# EasyEDA Pro project stm32f401rct6v1.eprj, board STM32F401RCT6
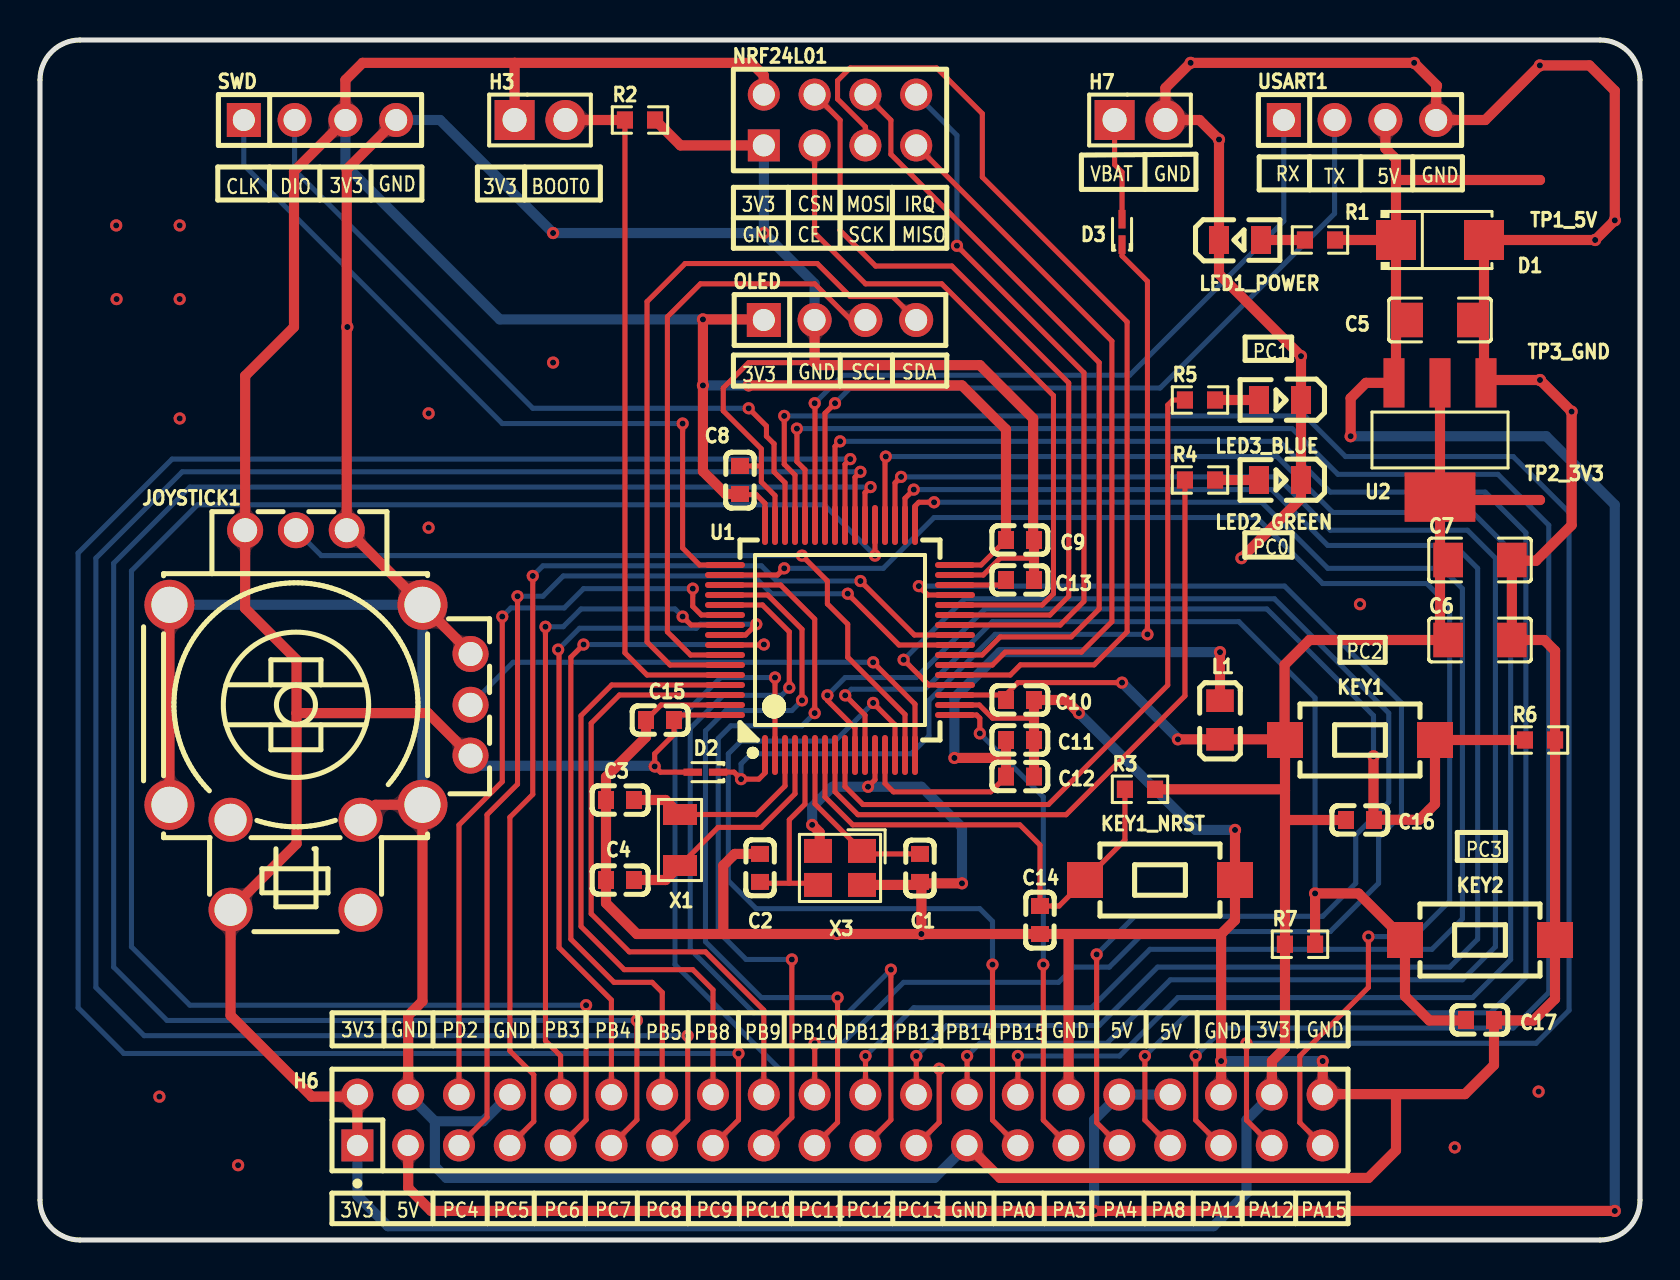
[diagram p3: board, top side]
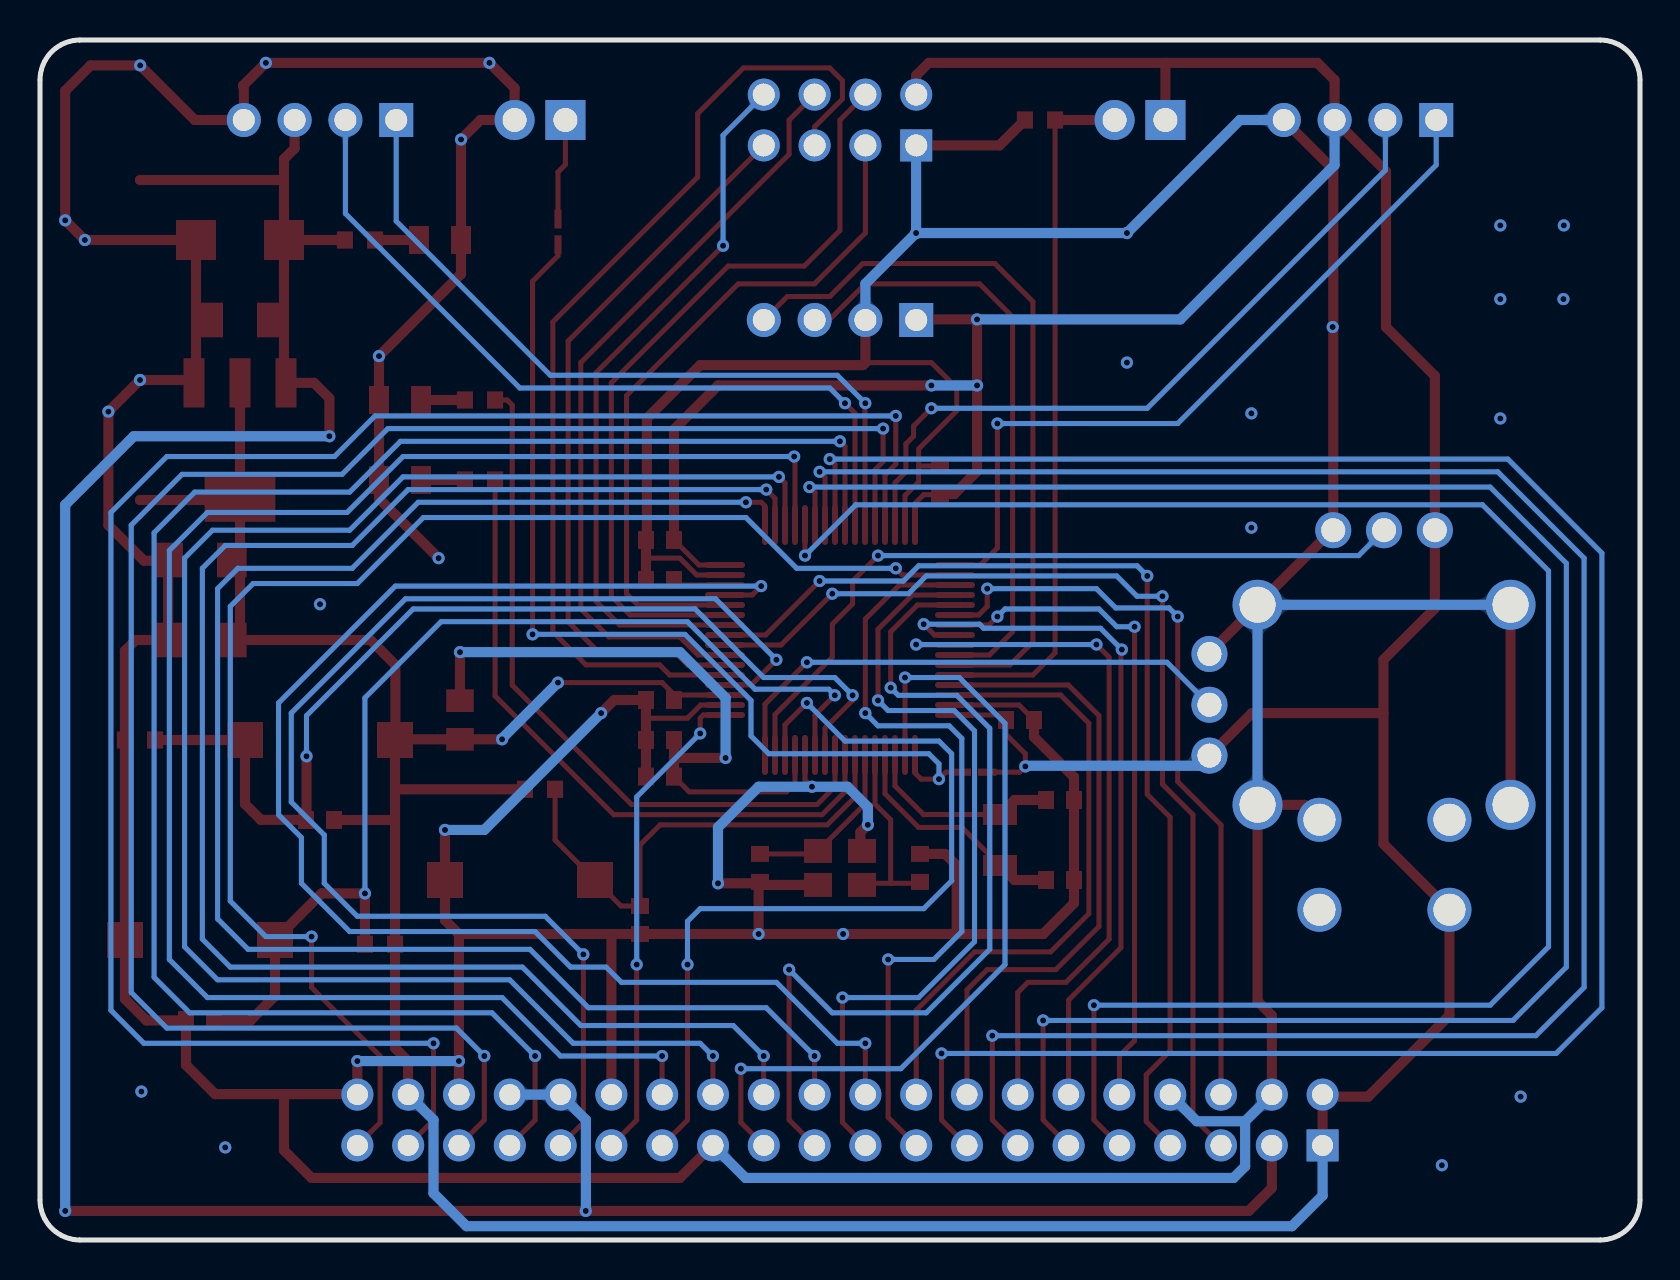
[diagram p4: board, bottom side, seen from below]

Outline 80 x 60 mm; copper layers: Top Layer, Bottom Layer. Coordinates in mm from the lower left corner of the outline.
Outline path: 0,58 0,2 arc(0.59,0.59) 2,0 78,0 arc(79.41,0.59) 80,2 80,58 arc(79.41,59.41) 78,60 2,60 arc(0.59,59.41) 0,58
Stack: Top Layer 0.035mm / Dielectric1 1.51mm FR4 er 4.5 / Bottom Layer 0.035mm

## Design rules (mm)
template: JLCPCB Capability(Two Layers Board)
spacing copperThickness1oz (default): track to track 0.102, other pairs 0.152 to 0.3
spacing copperThickness2oz: track to track 0.203, other pairs 0.152 to 0.3
track width copperThickness1oz (default): min 0.127, default 0.254, max 2.54
track width copperThickness2oz: min 0.203, default 0.254, max 2.54
differential pair differentialPair (default): width min 0.127, default 0.254, max 2.54; gap min 0.152, default 0.152
via viaSize (default): diameter min 0.5, default 0.61, max 10; hole min 0.3, default 0.305, max 6.3

## Placement (name value [footprint] x y rotation side)
C1  22pF  [C0603]  44 18.6 90 top
C2  22pF  [C0603]  36 18.6 270 top
C3  6pF  [C0603]  29 22 180 top
C4  6pF  [C0603]  29 18 180 top
C5  47uF  [C1206]  70 46 0 top
C6  47uF  [C1206]  72 30 0 top
C7  100nF  [C1206]  72 34 0 top
C8  100nF  [C0603]  35 38 90 top
C9  100nF  [C0603]  49 35 0 top
C10  100nF  [C0603]  49 27 0 top
C11  1uF  [C0603]  49 25 0 top
C12  10nF  [C0603]  49 23.17 0 top
C13  4.7uF  [C0603]  49 33 0 top
C14  100nF  [C0603]  50 16 90 top
C15  100nF  [C0603]  31 26 180 top
C16  100nF  [C0603]  66 21 0 top
C17  100nF  [C0603]  72 11 0 top
D1  SMAJ5.0A  [SMA_L4.3-W2.6-LS5.2-RD]  70 50 0 top
D2  1N4148WT  [SOD-523_L1.2-W0.8-LS1.6-RD]  33.27 23.39 180 top
D3  1N4148WT  [SOD-523_L1.2-W0.8-LS1.6-RD]  54.1 50.41 90 top
H3  PZ254V-11-02P  [HDR-TH_2P-P2.54-V-M]  25 56 0 top
H6  X6521WV-2x20H-C60D30  [HDR-TH_40P-2.54-V-M-R2-C20-S2.54]  40 6 0 top
H7  PZ254V-11-02P  [HDR-TH_2P-P2.54-V-M]  55 56 0 top
JOYSTICK1  THB001P  [SW-TH_THB001P]  14 26 0 top
KEY1  TC-3602-4.3-260G  [KEY-SMD_L6.0-W3.6-LS8.3-L]  66 25 0 top
KEY1_NRST  TC-3602-4.3-260G  [KEY-SMD_L6.0-W3.6-LS8.3-L]  56 18 0 top
KEY2  TC-3602-4.3-260G  [KEY-SMD_L6.0-W3.6-LS8.3-L]  72 15 0 top
L1  10uH  [L0805]  59 26 90 top
LED1_POWER  NCD0805R1  [LED0805-R-RD]  60 50 0 top
LED2_GREEN  NCD0805G1  [LED0805-R-RD]  62 38 180 top
LED3_BLUE  NCD0805B2  [LED0805-R-RD]  62 42 180 top
NRF24L01  DS1023-2*4SF11  [HDR-TH_8P-P2.54-V-F-R2-C4-S2.54]  40 56 0 top
OLED  PM254V-11-04-H85  [HDR-TH_4P-P2.54-V-F]  40 46 0 top
R1  1kΩ  [r0603]  64 50 180 top
R2  10kΩ  [R0603]  30 56 0 top
R3  10kΩ  [R0603]  55 22.53 0 top
R4  330Ω  [R0603]  58 38 0 top
R5  330Ω  [R0603]  58 42 0 top
R6  10kΩ  [R0603]  75 25 0 top
R7  10kΩ  [R0603]  63 14.79 0 top
SWD  PZ254V-11-04P  [HDR-TH_4P-P2.54-V-M]  14 56 0 top
TP1_5V  -  [Test-Point-0.5mm]  75 53 0 top
TP2_3V3  -  [Test-Point-0.5mm]  75 37 0 top
TP3_GND  -  [Test-Point-0.5mm]  75 43 0 top
U1  STM32F401RCT6  [LQFP-64_L10.0-W10.0-P0.50-LS12.0-BL]  40 30 0 top
U2  AMS1117-3.3  [SOT-223_L6.5-W3.5-P2.30-LS7.0-BR]  70 40 90 top
USART1  PZ254V-11-04P  [HDR-TH_4P-P2.54-V-M]  66 56 0 top
X1  32.768kHz  [OSC-SMD_L3.2-W1.5]  32 20 270 top
X3  25MHz  [CRYSTAL-SMD_4P-L3.2-W2.5-BL]  40 18.6 180 top

## Footprints (pads in the part's own frame, mm; a bottom-side part is the same pattern mirrored in y, then rotated)
C0603
  rect 0.8x0.9 smd: 1(-0.7,0) 2(0.7,0)
C1206
  rect 1.485x1.728 smd: 1(-1.593,0) 2(1.593,0)
CRYSTAL-SMD_4P-L3.2-W2.5-BL
  rect 1.4x1.2 smd: 1(-1.1,-0.85) 2(1.1,-0.85) 3(1.1,0.85) 4(-1.1,0.85)
HDR-TH_2P-P2.54-V-M
  rect 2x2 hole 1.2: 1(-1.27,0)
  round 2 hole 1.2: 2(1.27,0)
HDR-TH_4P-P2.54-V-F
  rect 1.7x1.7 hole 1.1: 1(-3.81,0)
  round 1.7 hole 1.1: 2(-1.27,0) 3(1.27,0) 4(3.81,0)
HDR-TH_4P-P2.54-V-M
  rect 1.7x1.7 hole 1.1: 1(-3.81,0)
  round 1.7 hole 1.1: 2(-1.27,0) 3(1.27,0) 4(3.81,0)
HDR-TH_8P-P2.54-V-F-R2-C4-S2.54
  rect 1.6x1.6 hole 1.1: 1(-3.81,-1.27)
  round 1.6 hole 1.1: 2(-3.81,1.27) 3(-1.27,-1.27) 4(-1.27,1.27) 5(1.27,-1.27) 6(1.27,1.27) 7(3.81,-1.27) 8(3.81,1.27)
HDR-TH_40P-2.54-V-M-R2-C20-S2.54
  rect 1.6x1.6 hole 1.05: 1(-24.13,-1.27)
  round 1.6 hole 1.05: 2(-24.13,1.27) 3(-21.59,-1.27) 4(-21.59,1.27) 5(-19.05,-1.27) 6(-19.05,1.27) 7(-16.51,-1.27) 8(-16.51,1.27) 9(-13.97,-1.27) 10(-13.97,1.27) 11(-11.43,-1.27) 12(-11.43,1.27) 13(-8.89,-1.27) 14(-8.89,1.27) 15(-6.35,-1.27) 16(-6.35,1.27) 17(-3.81,-1.27) 18(-3.81,1.27) 19(-1.27,-1.27) 20(-1.27,1.27) 21(1.27,-1.27) 22(1.27,1.27) 23(3.81,-1.27) 24(3.81,1.27) 25(6.35,-1.27) 26(6.35,1.27) 27(8.89,-1.27) 28(8.89,1.27) 29(11.43,-1.27) 30(11.43,1.27) 31(13.97,-1.27) 32(13.97,1.27) 33(16.51,-1.27) 34(16.51,1.27) 35(19.05,-1.27) 36(19.05,1.27) 37(21.59,-1.27) 38(21.59,1.27) 39(24.13,-1.27) 40(24.13,1.27)
KEY-SMD_L6.0-W3.6-LS8.3-L
  rect 1.8x1.8 smd: 1(-3.75,0) 2(3.75,0)
L0805
  rect 1.133x1.377 smd: 1(-0.966,0) 2(0.966,0)
LED0805-R-RD
  rect 1x1.399 smd: 1(1.05,0) 2(-1.05,0)
LQFP-64_L10.0-W10.0-P0.50-LS12.0-BL
  oval 0.3x2 smd: 1(-3.75,-5.75) 2(-3.25,-5.75) 3(-2.75,-5.75) 4(-2.25,-5.75) 5(-1.75,-5.75) 6(-1.25,-5.75) 7(-0.75,-5.75) 8(-0.25,-5.75) 9(0.25,-5.75) 10(0.75,-5.75) 11(1.25,-5.75) 12(1.75,-5.75) 13(2.25,-5.75) 14(2.75,-5.75) 15(3.25,-5.75) 16(3.75,-5.75) 33(3.75,5.75) 34(3.25,5.75) 35(2.75,5.75) 36(2.25,5.75) 37(1.75,5.75) 38(1.25,5.75) 39(0.75,5.75) 40(0.25,5.75) 41(-0.25,5.75) 42(-0.75,5.75) 43(-1.25,5.75) 44(-1.75,5.75) 45(-2.25,5.75) 46(-2.75,5.75) 47(-3.25,5.75) 48(-3.75,5.75)
  oval 2x0.3 smd: 17(5.75,-3.75) 18(5.75,-3.25) 19(5.75,-2.75) 20(5.75,-2.25) 21(5.75,-1.75) 22(5.75,-1.25) 23(5.75,-0.75) 24(5.75,-0.25) 25(5.75,0.25) 26(5.75,0.75) 27(5.75,1.25) 28(5.75,1.75) 29(5.75,2.25) 30(5.75,2.75) 31(5.75,3.25) 32(5.75,3.75) 49(-5.75,3.75) 50(-5.75,3.25) 51(-5.75,2.75) 52(-5.75,2.25) 53(-5.75,1.75) 54(-5.75,1.25) 55(-5.75,0.75) 56(-5.75,0.25) 57(-5.75,-0.25) 58(-5.75,-0.75) 59(-5.75,-1.25) 60(-5.75,-1.75) 61(-5.75,-2.25) 62(-5.75,-2.75) 63(-5.75,-3.25) 64(-5.75,-3.75)
OSC-SMD_L3.2-W1.5
  rect 1.05x1.7 smd: 1(-1.275,0) 2(1.275,0)
r0603
  rect 0.807x0.864 smd: 1(-0.753,0)
  rect 0.806x0.864 smd: 2(0.753,0)
R0603
  rect 0.806x0.864 smd: 1(-0.753,0) 2(0.753,0)
SMA_L4.3-W2.6-LS5.2-RD
  rect 2x2 smd: 1(-2.2,0) 2(2.2,0)
SOD-523_L1.2-W0.8-LS1.6-RD
  rect 0.93x0.36 smd: 1(-0.635,0) 2(0.635,0)
SOT-223_L6.5-W3.5-P2.30-LS7.0-BR
  rect 2.465x1.05 smd: 1(2.857,-2.3) 2(2.857,0) 3(2.857,2.3)
  rect 2.465x3.54 smd: 4(-2.857,0)
SW-TH_THB001P
  round 1.8 hole 1.2: 1(7.527,-1.78) 2(7.527,0.76) 3(7.527,3.3) 4(1.337,9.49) 5(-1.202,9.49) 6(-3.743,9.49)
  round 2.5 hole 1.8: 7(-7.527,5.76) 8(-7.527,-4.24) 9(5.122,-4.24) 10(5.122,5.76)
  round 2.2 hole 1.6: a(-4.472,-4.99) b(2.028,-4.99) c(-4.472,-9.49) d(2.028,-9.49)
Test-Point-0.5mm
  round 0.5 smd: 1(0,0)

## Nets
As in the schematic.

Pads without a net: JOYSTICK1 a d

## Via types
v1: diameter 0.61, hole 0.305, Top Layer to Bottom Layer, 111 vias

## Routing (per net, layer and track width the routed paths; a pad name or vN(x,y) marks a point on that pad's centre or on a via; arc(x,y) is an arc through that point)
3V3: length 307.2
  Top Layer w0.254: C8.1 35.03,37.27 35.81,37.27 36.25,36.83 U1.48 ; U1.64 31.95,26.25 C15.1 31.7,25.28 30.73,24.31 v1(30.73,23.68) 31.02,23.39 D2.2 ; 48.3,27.25 U1.19 ; 48.3,27.25 48.3,27.27 48.9,27.87 v1(54.1,27.87) ; 48.3,27.25 C10.1 ; C9.1 47.05,33.75 U1.32
  Top Layer w0.508: 12.83,26.34 19.4,26.34 JOYSTICK1.1 ; 12.83,26.34 12.83,19.81 JOYSTICK1.c 9.53,11.23 13.59,7.17 15.77,7.17 H6.2 H6.1 ; 12.83,26.34 12.83,29.01 10.26,31.58 JOYSTICK1.6 10.26,43.21 12.7,45.65 12.7,53.43 SWD.3 15.27,58 16.13,58.86 23.73,58.86 ; 23.73,58.86 35.56,58.86 36.19,58.23 NRF24L01.2 ; 23.73,58.86 H3.1 ; H6.38 61.59,7.28 61.59,8.95 62.25,9.6 62.25,14.79 ; v1(56.9,25.03) L1.1 62.22,25.03 62.23,25.02 ; 62.25,22.48 62.25,14.79 ; 62.25,22.48 62.19,22.53 R3.2 ; 62.25,22.48 KEY1.1 62.23,25.02 ; 62.25,14.79 R7.1 ; 62.23,25.02 62.23,28.76 63.47,30 C6.1 70,30.41 U2.4 ; OLED.1 36.16,46.03 v1(33.15,46.03) v1(33.15,42.73) 33.15,38.43 34.28,37.3 C8.1 ; U2.4 70.14,37 TP2_3V3.1 ; U2.4 U2.2 ; v1(35.43,42.73) 46.1,42.73 48.3,40.53 C9.1 ; C16.1 62.25,21
  Bottom Layer w0.508: v1(35.43,42.73) v1(33.15,42.73) ; v1(33.15,46.03) 22.99,46.03 15.27,53.75 SWD.3 ; H6.1 15.87,2.22 17.4,0.69 58.67,0.69 60.32,2.34 60.32,6 H6.38 ; v1(56.9,25.03) 56.9,25.08 v1(54.1,27.87) ; JOYSTICK1.1 22.04,23.71 30.7,23.71 v1(30.73,23.68)
+5V: length 149.8
  Top Layer w0.508: v1(65.53,40.19) 65.53,42.09 66.3,42.86 U2.3 67.8,42.96 D1.1 ; v1(78.74,1.45) v1(52.71,1.45) 19.56,1.45 18.41,2.6 H6.3 ; 67.8,53 67.8,54.05 67.27,54.58 USART1.3 ; 67.8,53 D1.1 ; 67.8,53 TP1_5V.1 ; D1.1 R1.1
  Bottom Layer w0.508: v1(78.74,1.45) 78.74,36.76 75.31,40.19 v1(65.53,40.19) ; H6.34 H6.32 52.71,6 52.71,1.46 v1(52.71,1.45)
GND: length 472.4
  Top Layer w0.254: 36.07,38.7 36.07,37.9 36.75,37.22 U1.47 ; 36.07,38.7 36.07,39.55 34.16,41.46 34.16,42.6 35.43,43.87 38.73,43.87 ; 36.07,38.7 C8.2 ; v1(41.4,22.66) 41.75,23.01 U1.12 ; U1.18 46.97,26.75 47.62,26.09 49.7,26.09 ; U1.63 31.05,26.75 C15.2 ; U1.31 47.16,33.25 48.01,34.09 49.66,34.09
  Top Layer w0.508: 59.06,15.3 59.75,15.99 KEY1_NRST.2 v1(59.75,20.5) ; 59.06,15.3 59.06,15.3 v1(59.06,8.95) 59.06,7.28 H6.36 ; 59.06,15.3 C14.1 v1(44.07,15.3) ; 64.13,7.28 64.16,7.29 67.8,7.29 ; 64.13,7.28 H6.40 ; 64.13,7.28 v1(64.13,8.95) ; 34.16,15.3 29.84,15.3 28.3,16.84 C4.2 C3.2 28.3,23.15 30.3,25.15 C15.2 ; 34.16,15.3 v1(39.84,15.3) v1(44.07,15.3) ; 34.16,15.3 34.16,18.72 34.74,19.3 C2.1 ; R2.2 32.02,54.73 NRF24L01.1 ; C12.2 C11.2 C10.2 51.29,27 v1(51.94,26.34) ; JOYSTICK1.7 JOYSTICK1.8 ; X3.2 38.98,19.54 38.98,20.38 v1(38.61,20.76) ; v1(44.07,15.3) 44.07,17.83 ; 44.07,17.83 44,17.9 43.85,17.75 X3.4 ; 44.07,17.83 v1(46.1,17.83) 46.1,17.84 ; OLED.2 38.73,43.87 38.85,43.74 46.99,43.74 49.66,41.08 49.66,35.04 C9.2 C13.2 ; 46.38,4.72 48.01,3.1 66.42,3.1 67.8,4.48 67.8,7.29 ; H6.30 51.43,15.3 ; JOYSTICK1.b 16.78,21.76 JOYSTICK1.9 19.12,11.94 18.41,11.23 H6.4 ; JOYSTICK1.3 21.53,29.36 JOYSTICK1.10 15.39,35.49 JOYSTICK1.4 15.34,53.53 SWD.4 ; 67.8,7.29 71.25,7.29 72.7,8.75 C17.2 72.72,10.98 74.68,10.98 75.75,12.05 KEY2.2 75.75,15 R6.2 75.75,29.46 75.21,30 C6.2 C7.2 73.63,33.97 74.8,33.97 76.58,35.74 v1(76.58,41.42) v1(75,43) 72.44,43 U2.1 72.2,42.96 D1.2 v1(77.76,50) v1(78.74,50.98) 78.74,57.46 77.47,58.73 v1(74.99,58.73) 72.26,56 USART1.4 69.81,57.67 69.85,57.71 v1(68.71,58.86) v1(57.53,58.86) 56.27,57.6 H7.2 57.97,56 v1(58.95,55.03) LED1_POWER.2 58.95,48.29 v1(63.05,44.19) LED3_BLUE.2 LED2_GREEN.2 63.05,37.07 v1(60.07,34.09)
  Bottom Layer w0.508: v1(51.94,26.34) 57.78,20.5 v1(59.75,20.5) ; v1(59.06,8.95) v1(64.13,8.95) ; H6.8 22.16,5.94 19.74,5.94 ; JOYSTICK1.9 JOYSTICK1.10 JOYSTICK1.7 ; SWD.4 20,56 v1(25.65,50.35) v1(36.19,50.35) ; v1(46.1,17.83) 46.1,17.84 46.1,20.63 44.07,22.66 v1(41.4,22.66) 39.62,22.66 38.61,21.65 v1(38.61,20.76) ; NRF24L01.1 36.19,54.72 v1(36.19,50.35) ; H6.25 44.72,3.1 20.32,3.1 19.74,3.68 19.74,5.94 ; v1(36.19,50.35) 38.73,47.81 OLED.2 ; 19.74,5.94 H6.4
  vias: v1(3.81,50.73) v1(3.83,47.05) v1(5.97,7.17) v1(6.98,50.73) v1(6.98,47.05) v1(6.98,41.08) v1(9.91,3.74) v1(15.37,45.65) v1(19.43,41.33) v1(19.43,35.62) v1(25.65,43.87) v1(66,31.79) v1(70.74,4.63) v1(74.93,7.42)
VBAT: length 5.1
  Top Layer w0.254: D3.2 54.1,53.4 53.73,53.77 H7.1
VDDA: length 32
  Top Layer w0.254: U1.13 42.25,22.83 42.67,22.41 47.54,22.41 C12.1
  Top Layer w0.508: 48.3,24.1 C12.1 ; 48.3,24.1 v1(45.72,24.1) ; 48.3,24.1 C11.1 ; L1.2 v1(59,29.39)
  Bottom Layer w0.508: v1(45.72,24.1) 45.72,27.11 48.01,29.39 v1(59,29.39)
ADC1_CHAN1: length 37.9
  Top Layer w0.254: U1.15 43.25,26.28 40.39,29.14 40.39,30.79 39.37,31.81 39.37,32.95 v1(38.1,34.22)
  Bottom Layer w0.254: v1(38.1,34.22) 14.07,34.22 JOYSTICK1.5
ADC1_CHAN2: length 26.5
  Top Layer w0.254: v1(41.66,28.89) 43.75,26.79 U1.16
  Bottom Layer w0.254: JOYSTICK1.2 23.65,28.89 v1(41.66,28.89)
BOOT0: length 35.1
  Top Layer w0.254: U1.60 30.35,28.25 29.25,29.36 R2.1
  Top Layer w0.508: H3.2 R2.1
IIC_SCL: length 30.4
  Top Layer w0.254: U1.58 32.53,29.25 31.37,30.41 31.37,46.16 33.02,47.81 38.74,47.81 40.54,46 OLED.3
IIC_SDA: length 36.8
  Top Layer w0.254: U1.59 31.5,28.75 30.35,29.9 30.35,46.92 32.26,48.82 38.86,48.82 40.51,47.17 42.64,47.17 OLED.4
KEY1_DOWN: length 51.2
  Top Layer w0.254: v1(39.37,27.23) 39.37,26.98 40.75,25.6 U1.10
  Top Layer w0.508: v1(66.68,24.19) 66.68,21.03 C16.2 66.71,21.01 68.96,21.01 69.75,21.8 KEY1.2 R6.1
  Bottom Layer w0.254: v1(66.68,24.19) 66.68,26.22 61.34,31.55 47.24,31.55 43.81,28.12 40.26,28.12 v1(39.37,27.23)
KEY2_UP: length 54.1
  Top Layer w0.254: U1.11 41.25,26.24 v1(40.26,27.23)
  Top Layer w0.508: R7.2 v1(63.75,17.33) 65.92,17.33 KEY2.1 68.25,12.2 69.47,10.98 71.28,10.98 C17.1
  Bottom Layer w0.254: v1(63.75,17.33) 63.75,27.11 59.94,30.92 47.62,30.92 44.25,27.54 40.56,27.54 v1(40.26,27.23)
LED2_G: length 33.1
  Top Layer w0.254: R4.1 57.25,27.2 51.31,21.27 40.89,21.27 39.75,22.41 U1.8
LED3_B: length 35.5
  Top Layer w0.254: R5.1 56.64,42 56.39,41.75 56.39,27.74 50.42,21.77 41.15,21.77 40.25,22.67 U1.9
NRF24L01_CE: length 34.8
  Top Layer w0.254: NRF24L01.3 38.73,50.35 41.28,47.81 45.09,47.81 50.67,42.22 50.67,32.31 50.11,31.75 U1.28
NRF24L01_CSN: length 38.7
  Top Layer w0.254: U1.27 50.5,31.25 51.44,32.19 51.44,42.86 45.59,48.7 41.78,48.7 40,50.47 40,56 NRF24L01.4
NRF24L01_IRQ: length 35.7
  Top Layer w0.254: v1(45.85,49.71) 52.2,43.36 52.2,31.93 51.01,30.75 U1.26
  Bottom Layer w0.254: NRF24L01.8 45.85,55.23 v1(45.85,49.71)
NRST: length 25
  Top Layer w0.254: U1.7 39.25,22.15 40.64,20.76 48.99,20.76 50,19.75 C14.2 50.95,16.7 KEY1_NRST.1 54.25,20 R3.1
OSC32_IN: length 10
  Top Layer w0.254: U1.3 37.25,22.7 35.81,21.27 35.8,21.28 X1.1
  Top Layer w0.508: X1.1 31.28,22 C3.1
OSC32_OUT: length 11.8
  Top Layer w0.254: U1.4 37.75,22.31 36.07,20.63 33.91,20.63 X1.2
  Top Layer w0.508: C4.1 31.28,18 X1.2
OSC_IN: length 9.7
  Top Layer w0.254: 37.47,17.84 38.82,17.84 X3.3 ; 37.47,17.84 37.47,21.01 38.25,21.8 U1.5 ; 37.47,17.84 36.07,17.84 36,17.9
OSC_OUT: length 8.7
  Top Layer w0.254: C1.2 41.25,19.3 X3.1 38.75,21.8 U1.6
PA0: length 43.5
  Top Layer w0.254: U1.14 42.75,25.76 v1(41.66,26.85) ; v1(47.62,13.77) 47.62,6 H6.27
  Bottom Layer w0.254: v1(41.66,26.85) 39.75,24.95 35.05,24.95 34.42,24.31 34.42,17.96 35.81,16.57 46.99,16.57 47.62,15.93 v1(47.62,13.77)
PA3: length 24.5
  Top Layer w0.254: U1.17 46.83,26.25 46.99,26.09 v1(46.99,25.33) ; v1(50.16,13.77) 50.16,6 H6.29
  Bottom Layer w0.254: v1(50.16,13.77) 50.16,22.15 v1(46.99,25.33)
PA4: length 64.6
  Top Layer w0.254: H6.31 52.83,5.87 v1(52.83,14.28) ; v1(43.18,29.01) 44.44,27.75 U1.20
  Bottom Layer w0.254: v1(43.18,29.01) 46.23,32.06 61.72,32.06 67.44,26.34 67.44,21.9 65.79,20.25 65.79,17.84 64.13,16.19 54.74,16.19 v1(52.83,14.28)
PA8: length 88.4
  Top Layer w0.254: U1.41 39.75,39.68 v1(40,39.93) ; H6.33 55.25,6 v1(55.25,9.2)
  Bottom Layer w0.254: v1(40,39.93) 61.98,39.93 64.52,37.39 72.26,37.39 74.29,35.36 74.29,13.14 72.52,11.36 57.4,11.36 v1(55.25,9.2)
PA11: length 91.9
  Top Layer w0.254: U1.44 38.25,38.51 37.85,38.92 v1(37.85,40.57) ; H6.35 57.78,6 v1(57.78,9.2)
  Bottom Layer w0.254: v1(57.78,9.2) 59.18,10.6 73.66,10.6 75.44,12.38 75.44,35.74 72.9,38.28 64.9,38.28 62.61,40.57 v1(37.85,40.57)
PA12: length 94.3
  Top Layer w0.254: v1(60.32,9.84) 60.32,6 H6.37 ; v1(37.21,41.2) 37.21,38.79 37.75,38.25 U1.45
  Bottom Layer w0.254: v1(37.21,41.2) 63.25,41.2 65.28,39.17 73.66,39.17 76.45,36.38 76.45,11.49 74.8,9.84 v1(60.32,9.84)
PA15: length 71.1
  Top Layer w0.254: H6.39 62.99,5.87 62.99,9.2 66.42,12.63 v1(66.42,15.17) ; v1(37.21,33.58) 36.88,33.25 U1.50
  Bottom Layer w0.254: v1(66.42,15.17) 68.71,15.17 70.49,16.95 70.49,31.68 69.34,32.82 64.13,32.82 60.83,36.12 44.7,36.12 42.16,33.58 v1(37.21,33.58)
PB3: length 33.4
  Top Layer w0.254: U1.55 32.55,30.75 v1(32.13,31.17) ; v1(25.27,30.66) 25.27,9.96 26.03,9.21 H6.10
  Bottom Layer w0.254: v1(32.13,31.17) 31.75,31.55 27.05,31.55 26.16,30.66 v1(25.27,30.66)
PB4: length 35.6
  Top Layer w0.254: v1(35.81,30.79) 35.27,30.25 U1.56 ; H6.12 28.57,12 25.95,14.62 25.95,29.47 v1(25.91,29.52)
  Bottom Layer w0.254: v1(25.91,29.52) 26.97,30.59 32.82,30.59 33.02,30.79 v1(35.81,30.79)
PB5: length 36.8
  Top Layer w0.254: U1.57 36.17,29.75 v1(36.19,29.77) ; v1(27.18,29.77) 26.54,29.14 26.54,15.04 28.7,12.88 30.61,12.88 31.12,12.38 31.12,9.84 31.11,9.84 H6.14
  Bottom Layer w0.254: v1(36.19,29.77) v1(27.18,29.77)
PB8: length 31.5
  Top Layer w0.254: H6.16 33.65,12.51 32.64,13.52 29.21,13.52 27.05,15.68 27.05,26.22 28.58,27.75 U1.61
PB9: length 31.7
  Top Layer w0.254: U1.62 28.97,27.25 27.56,25.84 27.56,16.31 29.46,14.41 33.27,14.41 36.19,11.49 H6.18
PB10: length 72.1
  Top Layer w0.254: H6.20 38.74,7.28 v1(38.74,9.84) ; U1.29 44.39,32.25 v1(43.94,32.69)
  Bottom Layer w0.254: v1(38.74,9.84) 40.13,9.84 43.18,12.88 50.93,12.88 51.69,13.64 53.47,13.64 55.25,15.42 64.52,15.42 66.93,17.84 66.93,20.12 68.07,21.27 68.07,26.85 62.23,32.69 v1(43.94,32.69)
PB12: length 81.3
  Top Layer w0.254: U1.33 43.75,36.69 43.94,36.89 v1(44.7,36.89) ; H6.22 41.28,7.28 v1(41.28,9.2)
  Bottom Layer w0.254: v1(44.7,36.89) 61.09,36.89 64.39,33.58 70.1,33.58 71.12,32.57 71.12,16.06 69.6,14.53 55.5,14.53 52.58,11.61 43.69,11.61 v1(41.28,9.2)
PB13: length 82.7
  Top Layer w0.254: U1.34 43.25,37.08 v1(43.69,37.52) ; H6.24 43.81,7.28 v1(43.81,9.2)
  Bottom Layer w0.254: v1(43.69,37.52) 61.59,37.52 64.39,34.73 70.74,34.73 71.88,33.58 71.88,15.04 70.49,13.64 55.88,13.64 52.96,10.72 45.34,10.72 v1(43.81,9.2)
PB14: length 84
  Top Layer w0.254: v1(43.05,38.16) 42.75,37.85 U1.35 ; v1(46.35,9.2) 46.35,7.28 H6.26
  Bottom Layer w0.254: v1(46.35,9.2) 46.99,9.84 53.34,9.84 56.51,13.01 71.12,13.01 72.77,14.66 72.77,34.09 71.37,35.49 64.52,35.49 61.85,38.16 v1(43.05,38.16)
PB15: length 85.6
  Top Layer w0.254: v1(42.29,39.17) 42.25,39.13 U1.36 ; H6.28 48.9,7.28 v1(48.9,9.2)
  Bottom Layer w0.254: v1(42.29,39.17) 61.85,39.17 64.64,36.38 71.63,36.38 73.53,34.47 73.53,14.03 71.63,12.12 56.9,12.12 53.97,9.2 v1(48.9,9.2)
PC4: length 52.4
  Top Layer w0.254: v1(40.39,32.31) 42.95,29.75 U1.24 ; v1(23.88,32.19) 23.88,22.79 22.35,21.27 22.35,6.13 H6.5
  Bottom Layer w0.254: v1(23.88,32.19) 25.15,32.19 26.16,33.2 35.69,33.2 36.58,32.31 v1(40.39,32.31)
PC5: length 52.8
  Top Layer w0.254: H6.7 24.69,5.93 24.69,8.26 23.5,9.45 23.5,21.14 24.64,22.28 v1(24.64,33.2) 24.69,33.15 ; v1(41.02,32.95) 43.72,30.25 U1.25
  Bottom Layer w0.254: v1(24.64,33.2) 25.15,33.71 36.07,33.71 36.83,32.95 v1(41.02,32.95)
PC6: length 91.4
  Top Layer w0.254: v1(27.31,11.74) 27.31,6 H6.9 ; U1.37 v1(41.75,34.22)
  Bottom Layer w0.254: v1(27.31,11.74) 7.49,11.74 4.57,14.66 4.57,33.46 7.87,36.76 39.21,36.76 v1(41.75,34.22)
PC7: length 95.7
  Top Layer w0.254: v1(29.84,10.98) 29.84,6 H6.11 ; U1.38 41.25,37.37 v1(41.53,37.65)
  Bottom Layer w0.254: v1(41.53,37.65) 7.49,37.65 3.68,33.84 3.68,13.64 6.35,10.98 v1(29.84,10.98)
PC8: length 100.9
  Top Layer w0.254: H6.13 32.38,6 v1(32.38,10.22) ; U1.39 40.75,38.14 v1(41.02,38.41)
  Bottom Layer w0.254: v1(41.02,38.41) 7.11,38.41 2.79,34.09 2.79,12.63 5.21,10.22 v1(32.38,10.22)
PC9: length 105.8
  Top Layer w0.254: v1(34.93,9.33) 34.93,6 H6.15 ; U1.40 40.25,38.78 v1(40.51,39.05)
  Bottom Layer w0.254: v1(40.51,39.05) 6.6,39.05 1.91,34.35 1.91,11.61 4.19,9.33 v1(34.93,9.33)
PC10: length 39
  Top Layer w0.254: v1(38.74,26.34) 38.74,31.04 37.03,32.75 U1.51 ; v1(37.59,14.03) 37.59,6.13 H6.17
  Bottom Layer w0.254: v1(37.59,14.03) 35.31,14.03 33.91,15.42 33.91,25.08 34.54,25.71 38.1,25.71 v1(38.74,26.34)
PC11: length 39.7
  Top Layer w0.254: U1.52 36.39,32.25 38.1,30.54 v1(38.1,26.98) ; v1(39.88,12.12) 39.88,5.88 H6.19
  Bottom Layer w0.254: v1(38.1,26.98) 37.59,26.47 34.29,26.47 33.27,25.46 33.27,14.92 36.07,12.12 v1(39.88,12.12)
PC12: length 45
  Top Layer w0.254: v1(37.47,27.61) 37.47,30.41 36.12,31.75 U1.53 ; v1(42.54,13.52) 42.54,6 H6.21
  Bottom Layer w0.254: v1(42.54,13.52) 40.39,11.36 35.69,11.36 32.51,14.53 32.51,25.58 34.16,27.23 37.08,27.23 v1(37.47,27.61)
PC13: length 41.6
  Top Layer w0.254: H6.23 44.96,5.88 v1(44.96,8.56) ; U1.2 v1(36.75,28.12)
  Bottom Layer w0.254: v1(44.96,8.56) 36.96,8.56 31.75,13.77 31.75,25.84 34.04,28.12 v1(36.75,28.12)
PD2: length 37.6
  Top Layer w0.254: U1.54 33.07,31.25 32.64,31.68 v1(32.64,32.57) ; H6.6 20.95,20.75 23.11,22.92 v1(23.11,31.17)
  Bottom Layer w0.254: v1(23.11,31.17) 23.55,31.6 26.21,31.6 27.18,32.57 v1(32.64,32.57)
SPI1_MISO: length 36.6
  Top Layer w0.254: NRF24L01.7 53.59,44.95 53.59,30.92 52.07,29.39 48.26,29.39 47.62,28.75 U1.22
SPI1_MOSI: length 38.7
  Top Layer w0.254: NRF24L01.6 42.54,56 42.54,54.28 52.96,43.87 52.96,31.55 51.56,30.16 48.01,30.16 47.1,29.25 U1.23
SPI1_SCK: length 50.7
  Top Layer w0.254: U1.21 48.51,28.25 49.02,28.76 52.71,28.76 54.36,30.41 54.36,45.9 47.12,53.14 47.12,56.32 44.83,58.6 40.51,58.6 39.88,57.97 39.88,57.05 41.27,55.66 NRF24L01.5
SWCLK: length 38.2
  Top Layer w0.254: v1(32.13,40.82) 32.13,34.6 32.98,33.75 U1.49
  Bottom Layer w0.254: v1(32.13,40.82) 23.11,40.82 10.19,53.75 SWD.1
SWDIO: length 36.7
  Top Layer w0.254: v1(35.43,41.58) 36.32,40.7 36.32,40.19 36.7,39.81 36.7,38.41 37.25,37.86 U1.46
  Bottom Layer w0.254: v1(35.43,41.58) 24.64,41.58 12.73,53.49 SWD.2
USART1_RX: length 38.4
  Top Layer w0.254: v1(38.74,41.84) 38.75,41.82 U1.43
  Bottom Layer w0.254: v1(38.74,41.84) 40.13,43.24 54.48,43.24 62.19,50.94 USART1.1
USART1_TX: length 39.9
  Top Layer w0.254: v1(39.75,41.84) 39.25,41.34 U1.42
  Bottom Layer w0.254: v1(39.75,41.84) 40.51,42.6 56.01,42.6 64.73,51.32 USART1.2
VCAP1: length 2.7
  Top Layer w0.254: C13.1 48.05,32.75 U1.30
$1N3059: length 2.2
  Top Layer w0.508: LED1_POWER.1 R1.2
$1N4213: length 48.3
  Top Layer w0.254: D3.1 54.1,49.2 55.37,47.94 v1(55.37,30.28) ; D2.1 34.7,23.39 v1(35.05,23.04) 35.94,23.04 36.25,23.35 U1.1
  Bottom Layer w0.254: v1(35.05,23.04) 35.05,23.81 35.56,24.31 43.56,24.31 44.45,25.2 44.45,26.98 47.75,30.28 v1(55.37,30.28)
$1N8046: length 2.2
  Top Layer w0.508: R4.2 LED2_GREEN.1
$1N8049: length 2.2
  Top Layer w0.508: R5.2 LED3_BLUE.1

## Copper pours and planes (outline as drawn; the poured copper is in the pictures)
GND on Top Layer: 0,58 0.02,58.28 0.08,58.56 0.18,58.83 0.32,59.08 0.49,59.31 0.69,59.51 0.92,59.68 1.17,59.82 1.44,59.92 1.72,59.98 2,60 78,60 78.28,59.98 78.56,59.92 78.83,59.82 79.08,59.68 79.31,59.51 79.51,59.31 79.68,59.08 79.82,58.83 79.92,58.56 79.98,58.28 80,58 80,2 79.98,1.72 79.92,1.44 79.82,1.17 79.68,0.92 79.51,0.69 79.31,0.49 79.08,0.32 78.83,0.18 78.56,0.08 78.28,0.02 78,0 2,0 1.72,0.02 1.44,0.08 1.17,0.18 0.92,0.32 0.69,0.49 0.49,0.69 0.32,0.92 0.18,1.17 0.08,1.44 0.02,1.72 0,2
GND on Bottom Layer: 0,58 0.02,58.28 0.08,58.56 0.18,58.83 0.32,59.08 0.49,59.31 0.69,59.51 0.92,59.68 1.17,59.82 1.44,59.92 1.72,59.98 2,60 78,60 78.28,59.98 78.56,59.92 78.83,59.82 79.08,59.68 79.31,59.51 79.51,59.31 79.68,59.08 79.82,58.83 79.92,58.56 79.98,58.28 80,58 80,2 79.98,1.72 79.92,1.44 79.82,1.17 79.68,0.92 79.51,0.69 79.31,0.49 79.08,0.32 78.83,0.18 78.56,0.08 78.28,0.02 78,0 2,0 1.72,0.02 1.44,0.08 1.17,0.18 0.92,0.32 0.69,0.49 0.49,0.69 0.32,0.92 0.18,1.17 0.08,1.44 0.02,1.72 0,2

Small or netless copper shapes (teardrops, artwork), in the pictures only: 139 on Top Layer, 85 on Bottom Layer

## Text on the board
Top Silkscreen Layer: CLK | DIO | 3V3 | GND | 5V | PD2 | PC4 | PC5 | BOOT0 | PB3 | PC6 | PB4 | PC7 | PB5 | PC8 | PB8 | PC9 | PB9 | PC10 | PB10 | CSN | CE | PC11 | PB12 | MOSI | PC12 | SCK | SCL | PB13 | PC13 | MISO | SDA | IRQ | PB14 | PB15 | PA0 | PA3 | VBAT | PA4 | PA8 | PA11 | PA12 | PC1 | PC0 | RX | PA15 | TX | PC2 | PC3
